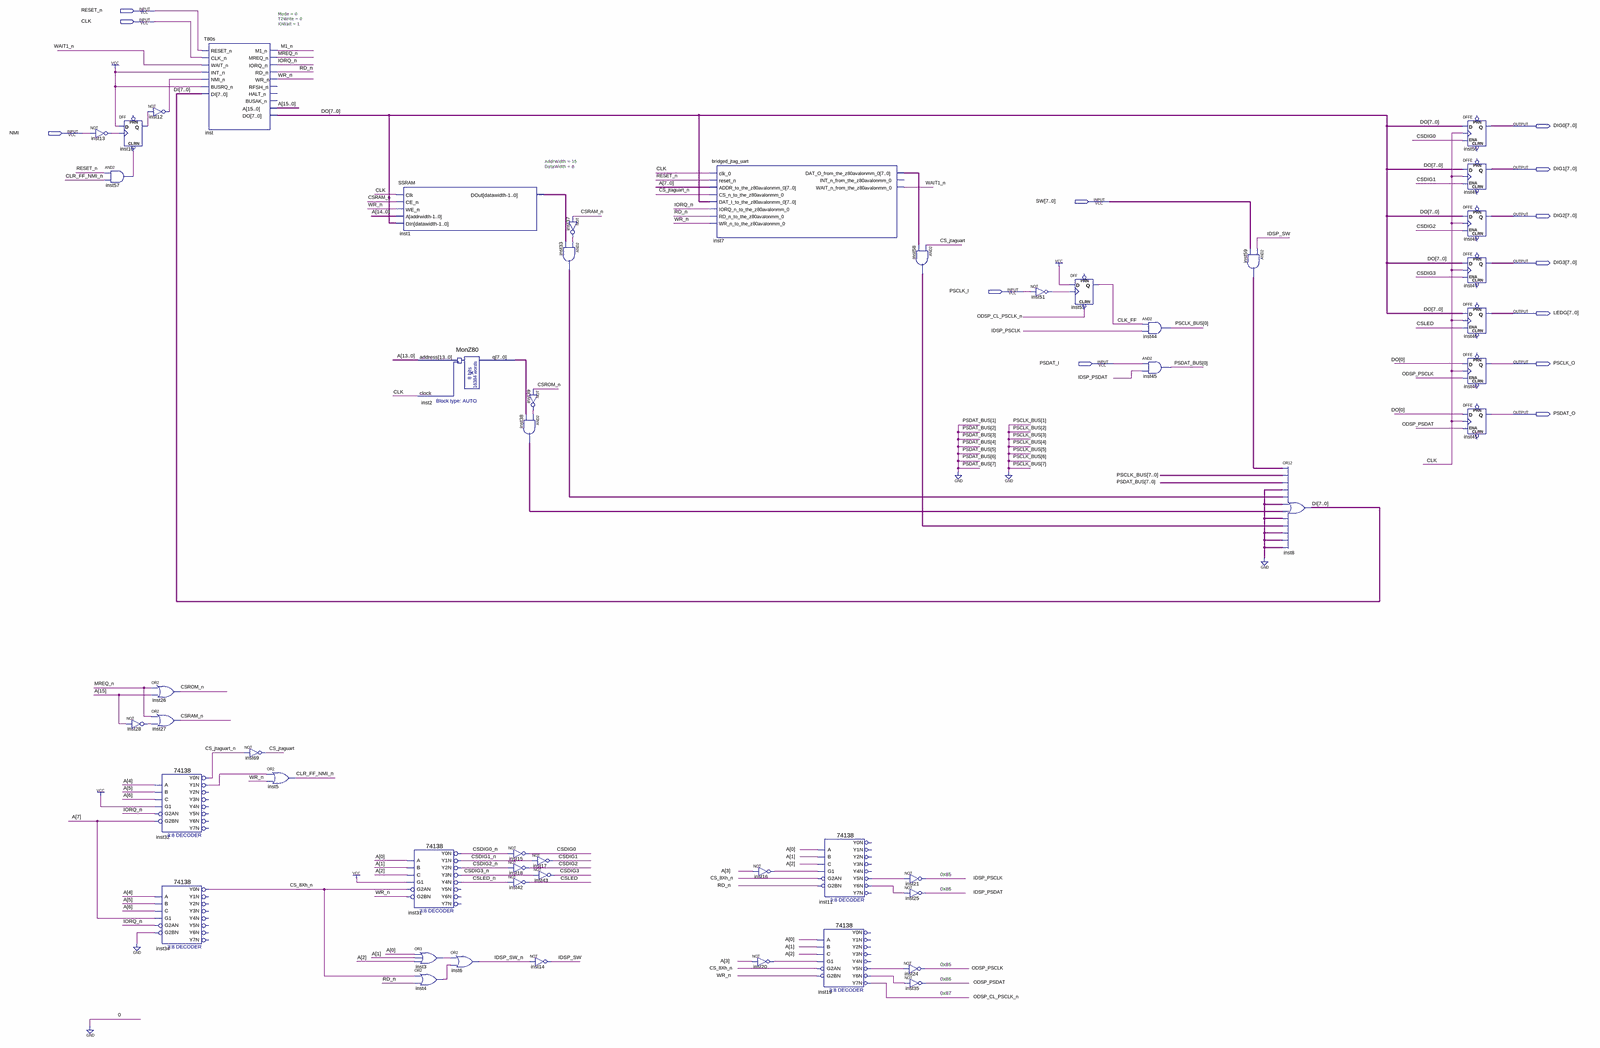
[diagram p0: schematic sheet, whole]
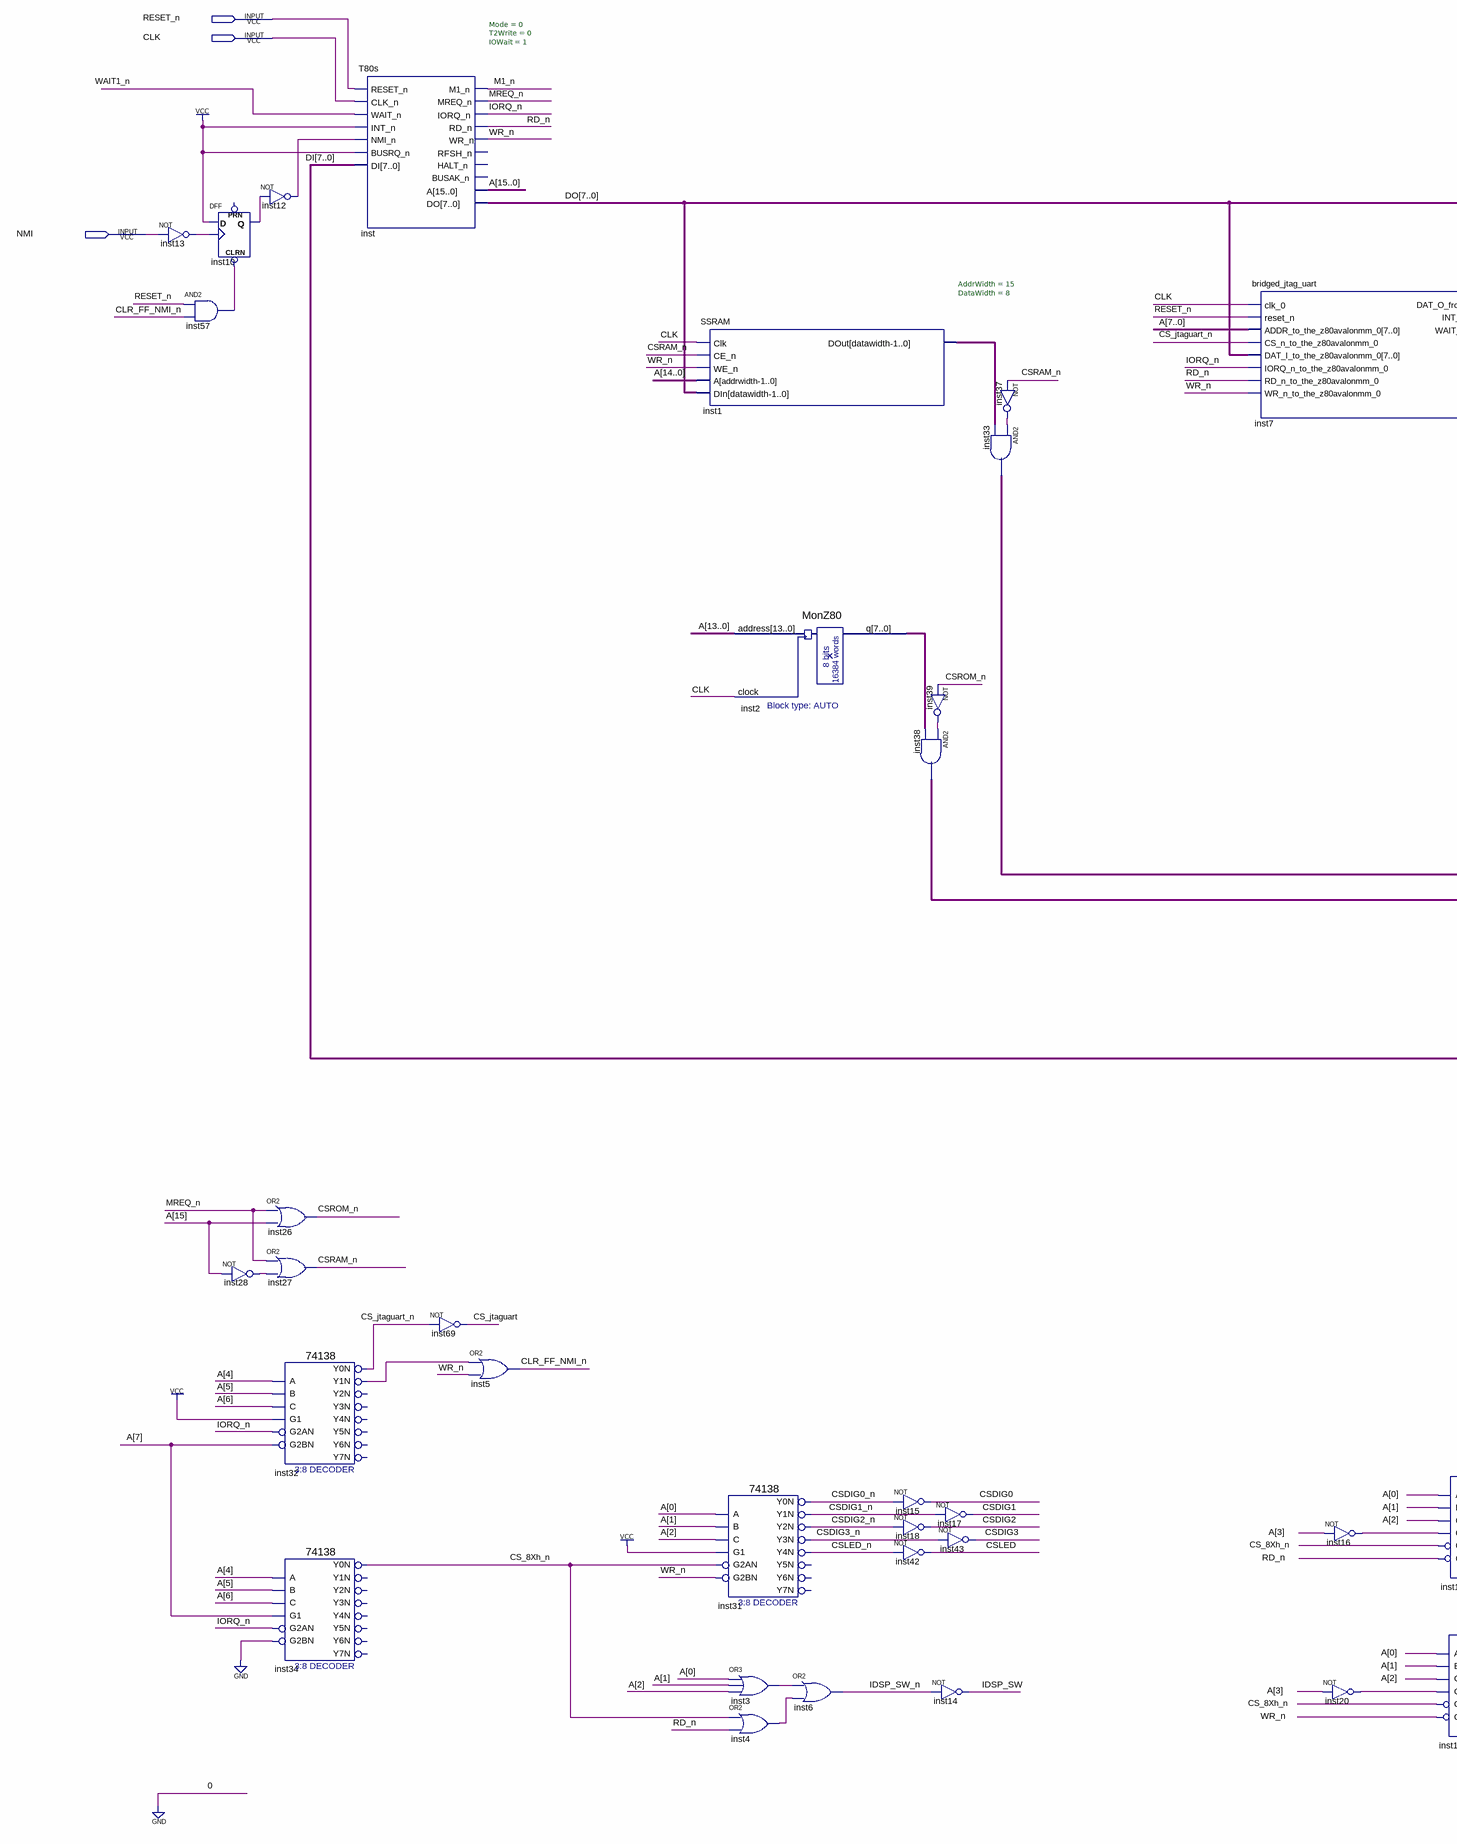
[diagram p1: schematic sheet, left part]
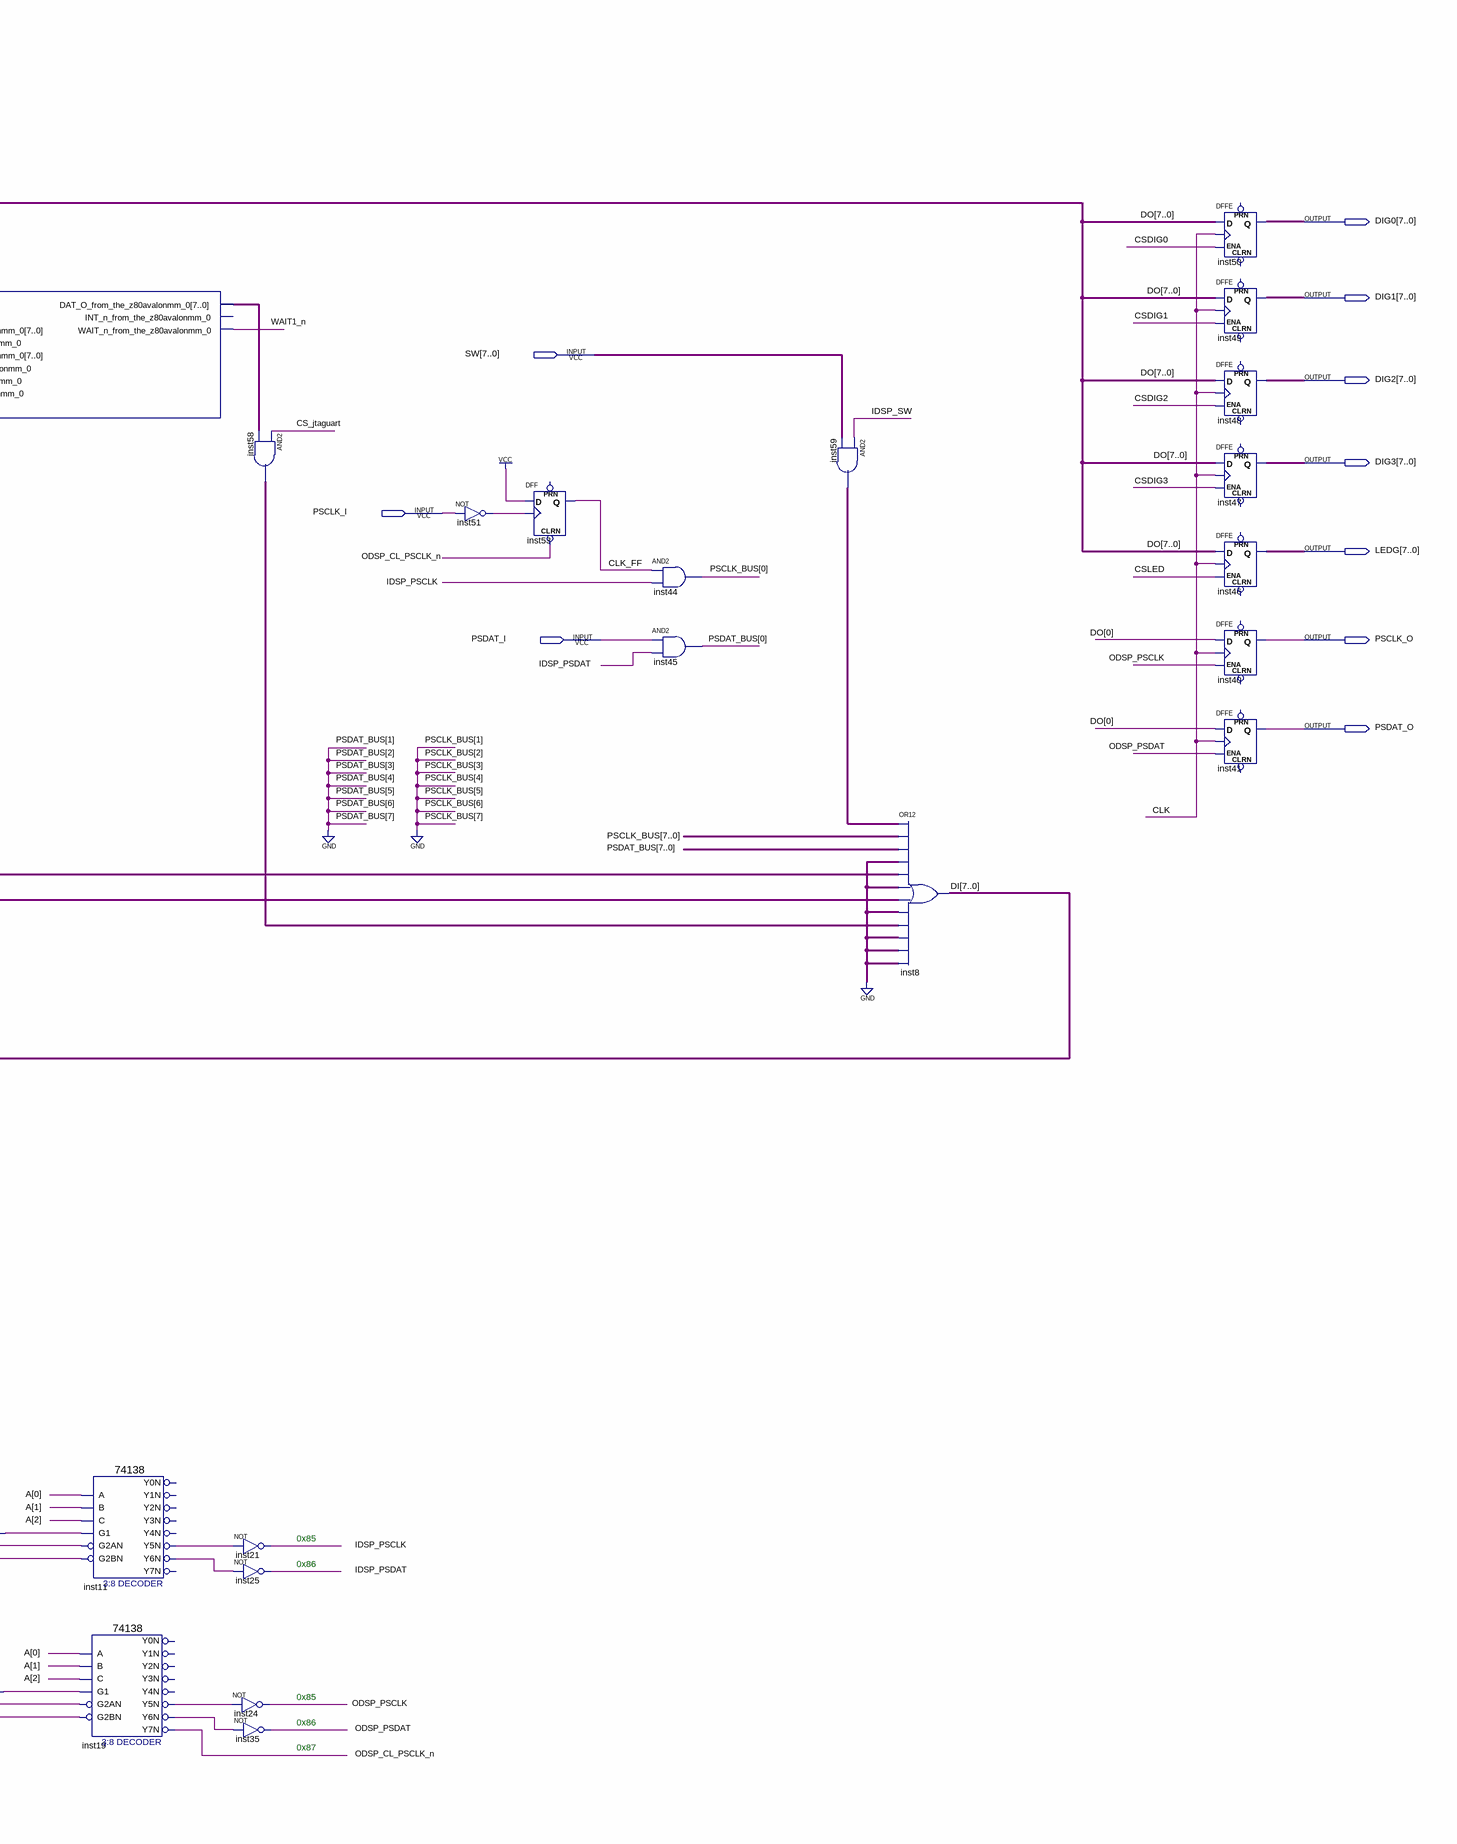
[diagram p2: schematic sheet, right part]
// Quartus schematic sistema.bdf as structural Verilog: 51 symbols, 13 pins
module sistema (
  input  RESET_n,
  input  CLK,
  input  NMI,
  input  [7:0] SW,
  input  PSCLK_I,
  input  PSDAT_I,
  output [7:0] DIG0,
  output [7:0] DIG1,
  output [7:0] DIG2,
  output [7:0] DIG3,
  output [7:0] LEDG,
  output PSCLK_O,
  output PSDAT_O
);

  wire CLK_FF, CLR_FF_NMI_n, CS_8Xh_n, CS_jtaguart, CS_jtaguart_n, CSDIG0, CSDIG0_n, CSDIG1, CSDIG1_n,
       CSDIG2, CSDIG2_n, CSDIG3, CSDIG3_n, CSLED, CSLED_n, CSRAM_n, CSROM_n, IDSP_PSCLK, IDSP_PSDAT, IDSP_SW,
       IDSP_SW_n, inst3_out, inst4_out, inst10_q, inst11_y5n, inst11_y6n, inst12_out, inst13_out, inst16_out,
       inst19_y5n, inst19_y6n, inst20_out, inst28_out, inst32_y1n, inst37_out, inst39_out, inst51_out,
       inst57_out, IORQ_n, M1_n, MREQ_n, ODSP_CL_PSCLK_n, ODSP_PSCLK, ODSP_PSDAT, RD_n, WAIT1_n, WR_n;
  wire [0:0] PSCLK_BUS, PSDAT_BUS;
  wire [7:0] DI, DO, inst1_dout, inst2_q, inst7_dat_o_from_the_z80avalonmm_0, inst33_out, inst38_out,
       inst58_out, inst59_out;
  wire [15:0] A;

  not inst13 (inst13_out, NMI);
  DFF inst10 (.CLRN(inst57_out), .CLK(inst13_out), .D(1'b1), .Q(inst10_q));  // open: PRN
  and inst57 (inst57_out, RESET_n, CLR_FF_NMI_n);
  not inst12 (inst12_out, inst10_q);
  not inst28 (inst28_out, A[15]);
  or inst26 (CSROM_n, MREQ_n, A[15]);
  or inst27 (CSRAM_n, MREQ_n, inst28_out);
  \74138  inst32 (
    .A(A[4]), .B(A[5]), .G1(1'b1), .C(A[6]), .G2AN(IORQ_n), .G2BN(A[7]), .Y0N(CS_jtaguart_n), .Y1N(inst32_y1n));  // open: Y2N, Y3N, Y4N, Y5N, Y6N, Y7N
  \74138  inst34 (
    .A(A[4]), .B(A[5]), .G1(A[7]), .C(A[6]), .G2AN(IORQ_n), .G2BN(1'b0), .Y0N(CS_8Xh_n));  // open: Y1N, Y2N, Y3N, Y4N, Y5N, Y6N, Y7N
  T80s #(.Mode(0), .T2Write(0), .IOWait(1)) inst (
    .RESET_n(RESET_n), .CLK_n(CLK), .WAIT_n(WAIT1_n), .INT_n(1'b1), .NMI_n(inst12_out), .BUSRQ_n(1'b1),
    .DI(DI), .M1_n(M1_n), .MREQ_n(MREQ_n), .IORQ_n(IORQ_n), .RD_n(RD_n), .WR_n(WR_n), .A(A), .DO(DO));  // open: RFSH_n, HALT_n, BUSAK_n
  not inst69 (CS_jtaguart, CS_jtaguart_n);
  or inst5 (CLR_FF_NMI_n, inst32_y1n, WR_n);
  SSRAM #(.AddrWidth(15), .DataWidth(8)) inst1 (
    .Clk(CLK), .CE_n(CSRAM_n), .WE_n(WR_n), .A(A[14:0]), .DIn(DO), .DOut(inst1_dout));
  \74138  inst31 (
    .A(A[0]), .B(A[1]), .G1(1'b1), .C(A[2]), .G2AN(CS_8Xh_n), .G2BN(WR_n), .Y0N(CSDIG0_n), .Y1N(CSDIG1_n),
    .Y2N(CSDIG2_n), .Y3N(CSDIG3_n), .Y4N(CSLED_n));  // open: Y5N, Y6N, Y7N
  MonZ80 inst2 (.address(A[13:0]), .clock(CLK), .q(inst2_q));
  or inst3 (inst3_out, A[0], A[1], A[2]);
  or inst4 (inst4_out, CS_8Xh_n, RD_n);
  or inst6 (IDSP_SW_n, inst3_out, inst4_out);
  assign inst38_out = {8{inst39_out}} & inst2_q;  // AND2 inst38, 8 bits wide
  not inst15 (CSDIG0, CSDIG0_n);
  not inst18 (CSDIG2, CSDIG2_n);
  not inst42 (CSLED, CSLED_n);
  not inst39 (inst39_out, CSROM_n);
  not inst17 (CSDIG1, CSDIG1_n);
  not inst43 (CSDIG3, CSDIG3_n);
  not inst14 (IDSP_SW, IDSP_SW_n);
  not inst37 (inst37_out, CSRAM_n);
  assign inst33_out = {8{inst37_out}} & inst1_dout;  // AND2 inst33, 8 bits wide
  bridged_jtag_uart inst7 (
    .clk_0(CLK), .reset_n(RESET_n), .ADDR_to_the_z80avalonmm_0(A[7:0]),
    .CS_n_to_the_z80avalonmm_0(CS_jtaguart_n), .DAT_I_to_the_z80avalonmm_0(DO),
    .IORQ_n_to_the_z80avalonmm_0(IORQ_n), .RD_n_to_the_z80avalonmm_0(RD_n), .WR_n_to_the_z80avalonmm_0(WR_n),
    .DAT_O_from_the_z80avalonmm_0(inst7_dat_o_from_the_z80avalonmm_0), .WAIT_n_from_the_z80avalonmm_0(WAIT1_n));  // open: INT_n_from_the_z80avalonmm_0
  not inst16 (inst16_out, A[3]);
  not inst20 (inst20_out, A[3]);
  \74138  inst11 (
    .A(A[0]), .B(A[1]), .G1(inst16_out), .C(A[2]), .G2AN(CS_8Xh_n), .G2BN(RD_n), .Y5N(inst11_y5n),
    .Y6N(inst11_y6n));  // open: Y0N, Y1N, Y2N, Y3N, Y4N, Y7N
  \74138  inst19 (
    .A(A[0]), .B(A[1]), .G1(inst20_out), .C(A[2]), .G2AN(CS_8Xh_n), .G2BN(WR_n), .Y5N(inst19_y5n),
    .Y6N(inst19_y6n), .Y7N(ODSP_CL_PSCLK_n));  // open: Y0N, Y1N, Y2N, Y3N, Y4N
  assign inst58_out = {8{CS_jtaguart}} & inst7_dat_o_from_the_z80avalonmm_0;  // AND2 inst58, 8 bits wide
  not inst21 (IDSP_PSCLK, inst11_y5n);
  not inst25 (IDSP_PSDAT, inst11_y6n);
  not inst24 (ODSP_PSCLK, inst19_y5n);
  not inst35 (ODSP_PSDAT, inst19_y6n);
  not inst51 (inst51_out, PSCLK_I);
  DFF inst53 (.CLRN(ODSP_CL_PSCLK_n), .CLK(inst51_out), .D(1'b1), .Q(CLK_FF));  // open: PRN
  and inst44 (PSCLK_BUS[0], CLK_FF, IDSP_PSCLK);
  and inst45 (PSDAT_BUS[0], PSDAT_I, IDSP_PSDAT);
  assign inst59_out = {8{IDSP_SW}} & SW;  // AND2 inst59, 8 bits wide
  assign DI = inst59_out | {{7{1'b0}}, PSCLK_BUS[0]} | {{7{1'b0}}, PSDAT_BUS[0]} | {8{1'b0}} | inst33_out | {8{1'b0}} | inst38_out | {8{1'b0}} | inst58_out | {8{1'b0}} | {8{1'b0}} | {8{1'b0}};  // OR12 inst8, 8 bits wide
  DFFE inst50[7:0] (.D(DO), .CLK(CLK), .ENA(CSDIG0), .Q(DIG0));  // open: PRN, CLRN
  DFFE inst49[7:0] (.D(DO), .CLK(CLK), .ENA(CSDIG1), .Q(DIG1));  // open: PRN, CLRN
  DFFE inst48[7:0] (.D(DO), .CLK(CLK), .ENA(CSDIG2), .Q(DIG2));  // open: PRN, CLRN
  DFFE inst47[7:0] (.D(DO), .CLK(CLK), .ENA(CSDIG3), .Q(DIG3));  // open: PRN, CLRN
  DFFE inst46[7:0] (.D(DO), .CLK(CLK), .ENA(CSLED), .Q(LEDG));  // open: PRN, CLRN
  DFFE inst40 (.D(DO[0]), .CLK(CLK), .ENA(ODSP_PSCLK), .Q(PSCLK_O));  // open: PRN, CLRN
  DFFE inst41 (.D(DO[0]), .CLK(CLK), .ENA(ODSP_PSDAT), .Q(PSDAT_O));  // open: PRN, CLRN

  // Notes on the sheet:
  //   0x85
  //   0x86
  //   0x85
  //   0x86
  //   0x87
endmodule
